# Altium project RK_NVR_DEMO1_RK3588_LP4XD200P232SD8_V21_20211228.PrjPcb (part 13 of 19)

## Sheet 67.Ethernet-GEPHY_RGMII0.SchDoc
size 420 x 297 mm; Revision: V2.1; Schematic Page Number: 11; Page Number: 31; Check: Default; Schematic Name: RK_NVR_DEMO1_RK3588_LP4/4x_V21; Page Count: 43; Page name: 67.Ethernet-GEPHY_RGMII0; Designer: Zhangdz; Schematic Page Count: 99; Revcode: V2.1; DsnPath: E:\Work\SBER\RK3588_SOM\temp\RK_NVR_DEMO1_RK3588_LP4XD200P232SD8_V21_20211228.DSN; SchematicName: RK_NVR_DEMO1_RK3588_LP4/4x_V21; PageName: 67.Ethernet-GEPHY_RGMII0; PageSize: A3; TopSchematic: True
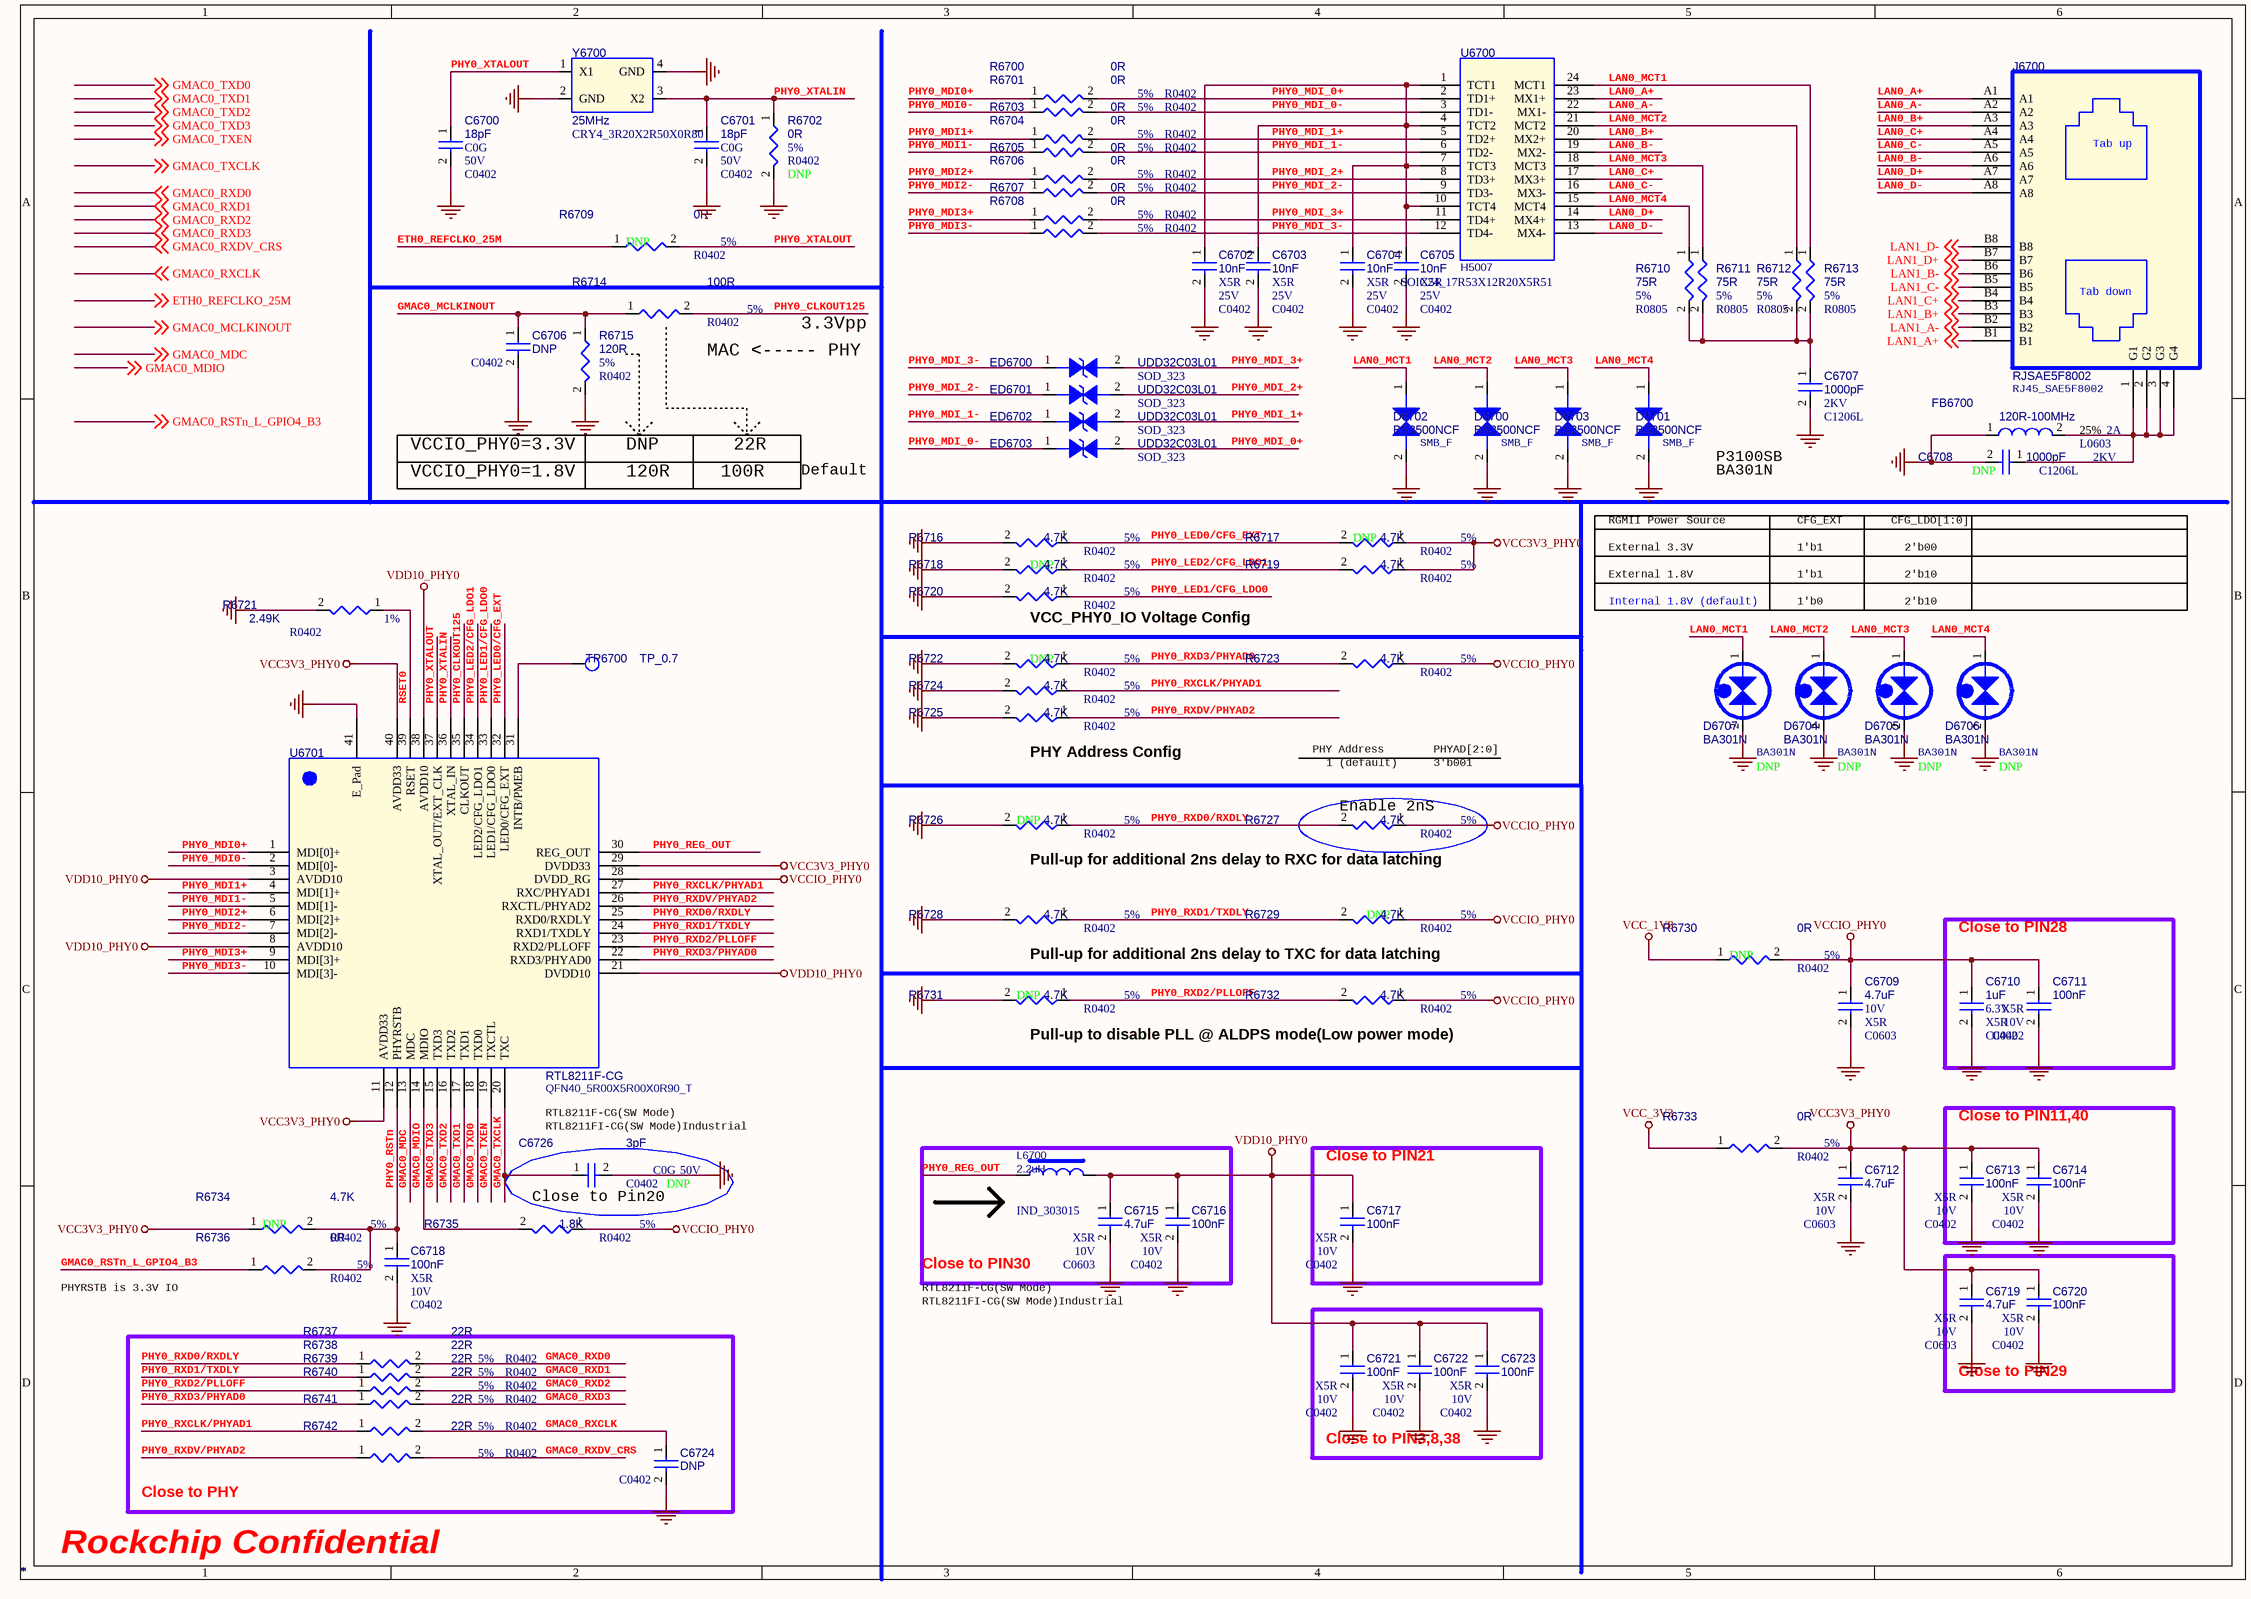
[diagram p58: 67.Ethernet-GEPHY_RGMII0.SchDoc]

### Parts
C6700  *  Voltage: 50V  Dielectric: C0G  [C0402]
C6701  *  Voltage: 50V  Dielectric: C0G  [C0402]
C6702  *  Voltage: 25V  Dielectric: X5R  [C0402]
C6703  *  Voltage: 25V  Dielectric: X5R  [C0402]
C6704  *  Voltage: 25V  Dielectric: X5R  [C0402]
C6705  *  Voltage: 25V  Dielectric: X5R  [C0402]
C6706  *  [C0402]
C6707  *  Voltage: 2KV  [C1206L]
C6708  *  Voltage: 2KV  option: DNP  [C1206L]
C6709  *  Voltage: 10V  Dielectric: X5R  [C0603]
C6710  *  Voltage: 6.3V  Dielectric: X5R  [C0402]
C6711  *  Voltage: 10V  Dielectric: X5R  [C0402]
C6712  *  Voltage: 10V  Dielectric: X5R  [C0603]
C6713  *  Voltage: 10V  Dielectric: X5R  [C0402]
C6714  *  Voltage: 10V  Dielectric: X5R  [C0402]
C6715  *  Voltage: 10V  Dielectric: X5R  [C0603]
C6716  *  Voltage: 10V  Dielectric: X5R  [C0402]
C6717  *  Voltage: 10V  Dielectric: X5R  [C0402]
C6718  *  Voltage: 10V  Dielectric: X5R  [C0402]
C6719  *  Voltage: 10V  Dielectric: X5R  [C0603]
C6720  *  Voltage: 10V  Dielectric: X5R  [C0402]
C6721  *  Voltage: 10V  Dielectric: X5R  [C0402]
C6722  *  Voltage: 10V  Dielectric: X5R  [C0402]
C6723  *  Voltage: 10V  Dielectric: X5R  [C0402]
C6724  *  [C0402]
C6726  *  Voltage: 50V  Dielectric: C0G  option: DNP  [C0402]
D6700  *  PCB Footprint: SMB_F  [BA301N]
D6701  *  PCB Footprint: SMB_F  [BA301N]
D6702  *  PCB Footprint: SMB_F  [BA301N]
D6703  *  PCB Footprint: SMB_F  [BA301N]
D6704  *  option: DNP  [BA301N]
D6705  *  option: DNP  [BA301N]
D6706  *  option: DNP  [BA301N]
D6707  *  option: DNP  [BA301N]
ED6700  *  [SOD_323]
ED6701  *  [SOD_323]
ED6702  *  [SOD_323]
ED6703  *  [SOD_323]
FB6700  *  Tolerance: 25%  Irms: 2A  [L0603]
J6700  *  PCB Footprint: RJ45_SAE5F8002  [RJSAE5F8002]
L6700  *  [IND_303015]
R6700  *  Tolerance: 5%  [R0402]
R6701  *  Tolerance: 5%  [R0402]
R6702  *  Tolerance: 5%  option: DNP  [R0402]
R6703  *  Tolerance: 5%  [R0402]
R6704  *  Tolerance: 5%  [R0402]
R6705  *  Tolerance: 5%  [R0402]
R6706  *  Tolerance: 5%  [R0402]
R6707  *  Tolerance: 5%  [R0402]
R6708  *  Tolerance: 5%  [R0402]
R6709  *  Tolerance: 5%  Option: DNP  [R0402]
R6710  *  PCB Footprint: R0805  Tolerance: 5%  [R0402]
R6711  *  PCB Footprint: R0805  Tolerance: 5%  [R0402]
R6712  *  PCB Footprint: R0805  Tolerance: 5%  [R0402]
R6713  *  PCB Footprint: R0805  Tolerance: 5%  [R0402]
R6714  *  Tolerance: 5%  [R0402]
R6715  *  Tolerance: 5%  [R0402]
R6716  *  Tolerance: 5%  [R0402]
R6717  *  Tolerance: 5%  option: DNP  [R0402]
R6718  *  Tolerance: 5%  option: DNP  [R0402]
R6719  *  Tolerance: 5%  [R0402]
R6720  *  Tolerance: 5%  [R0402]
R6721  *  Tolerance: 1%  [R0402]
R6722  *  Tolerance: 5%  option: DNP  [R0402]
R6723  *  Tolerance: 5%  [R0402]
R6724  *  Tolerance: 5%  [R0402]
R6725  *  Tolerance: 5%  [R0402]
R6726  *  Tolerance: 5%  option: DNP  [R0402]
R6727  *  Tolerance: 5%  [R0402]
R6728  *  Tolerance: 5%  [R0402]
R6729  *  Tolerance: 5%  option: DNP  [R0402]
R6730  *  Tolerance: 5%  option: DNP  [R0402]
R6731  *  Tolerance: 5%  option: DNP  [R0402]
R6732  *  Tolerance: 5%  [R0402]
R6733  *  Tolerance: 5%  [R0402]
R6734  *  Tolerance: 5%  Option: DNP  [R0402]
R6735  *  Tolerance: 5%  [R0402]
R6736  *  Tolerance: 5%  [R0402]
R6737  *  Tolerance: 5%  [R0402]
R6738  *  Tolerance: 5%  [R0402]
R6739  *  Tolerance: 5%  [R0402]
R6740  *  Tolerance: 5%  [R0402]
R6741  *  Tolerance: 5%  [R0402]
R6742  *  Tolerance: 5%  [R0402]
TP6700  *  [TEST]
U6700  *  [SOIC24_17R53X12R20X5R51]
U6701  *  PCB Footprint: QFN40_5R00X5R00X0R90_T  [QFN40_5R00X5R00X0R80_T]
Y6700  *  PCB Footprint: CRY4_3R20X2R50X0R80  [CRY-3225]

### Blocks framed on the sheet
Close to PIN28: C6710 C6711
Close to PIN11,40: C6713 C6714
Close to PIN30: C6715 C6716 L6700
Close to PIN21: C6717
Close to PIN29: C6719 C6720
Close to PIN3,8,38: C6721-C6723
Close to PHY: C6724 R6737-R6742

### Nets
GND: C6700.2 C6701.2 C6702.2 C6703.2 C6704.2 C6705.2 C6706.2 C6707.2 C6708.2 C6709.2 C6710.2 C6711.2 C6712.2 C6713.2 C6714.2 C6715.2 C6716.2 C6717.2 C6718.2 C6719.2 C6720.2 C6721.2 C6722.2 C6723.2 C6724.2 C6726.2 D6700.2 D6701.2 D6702.2 D6703.2 D6704.2 D6705.2 D6706.2 D6707.2 FB6700.1 R6702.2 R6715.2 R6716.2 R6718.2 R6720.2 R6721.2 R6722.2 R6724.2 R6725.2 R6726.2 R6728.2 R6731.2 U6701.41(E_Pad) Y6700.2(GND) Y6700.4(GND)
VCC3V3_PHY0: C6712.1 C6713.1 C6714.1 C6719.1 C6720.1 R6717.1 R6719.1 R6733.2 R6734.1 U6701.11(AVDD33) U6701.29(DVDD33) U6701.40(AVDD33)
VCC_1V8: R6730.1
VCC_3V3: R6733.1
VCCIO_PHY0: C6709.1 C6710.1 C6711.1 R6723.1 R6727.1 R6729.1 R6730.2 R6732.1 R6735.1 U6701.28(DVDD_RG)
VDD10_PHY0: C6715.1 C6716.1 C6717.1 C6721.1 C6722.1 C6723.1 L6700.2 U6701.3(AVDD10) U6701.8(AVDD10) U6701.21(DVDD10) U6701.38(AVDD10)
ETH0_REFCLKO_25M: R6709.1 ; off-sheet ETH0_REFCLKO_25M
GMAC0_MCLKINOUT: C6706.1 R6714.1 R6715.1 ; off-sheet GMAC0_MCLKINOUT
GMAC0_MDC: U6701.13(MDC) ; off-sheet GMAC0_MDC
GMAC0_MDIO: R6735.2 U6701.14(MDIO) ; off-sheet GMAC0_MDIO
GMAC0_RSTn_L_GPIO4_B3: R6736.1 ; off-sheet GMAC0_RSTn_L_GPIO4_B3
GMAC0_RXCLK: C6724.1 R6741.2 ; off-sheet GMAC0_RXCLK
GMAC0_RXD0: R6737.2 ; off-sheet GMAC0_RXD0
GMAC0_RXD1: R6738.2 ; off-sheet GMAC0_RXD1
GMAC0_RXD2: R6739.2 ; off-sheet GMAC0_RXD2
GMAC0_RXD3: R6740.2 ; off-sheet GMAC0_RXD3
GMAC0_RXDV_CRS: R6742.2 ; off-sheet GMAC0_RXDV_CRS
GMAC0_TXCLK: C6726.1 U6701.20(TXC) ; off-sheet GMAC0_TXCLK
GMAC0_TXD0: U6701.18(TXD0) ; off-sheet GMAC0_TXD0
GMAC0_TXD1: U6701.17(TXD1) ; off-sheet GMAC0_TXD1
GMAC0_TXD2: U6701.16(TXD2) ; off-sheet GMAC0_TXD2
GMAC0_TXD3: U6701.15(TXD3) ; off-sheet GMAC0_TXD3
GMAC0_TXEN: U6701.19(TXCTL) ; off-sheet GMAC0_TXEN
LAN0_A+: J6700.A1 U6700.23(MX1+)
LAN0_A-: J6700.A2 U6700.22(MX1-)
LAN0_B+: J6700.A3 U6700.20(MX2+)
LAN0_B-: J6700.A6 U6700.19(MX2-)
LAN0_C+: J6700.A4 U6700.17(MX3+)
LAN0_C-: J6700.A5 U6700.16(MX3-)
LAN0_D+: J6700.A7 U6700.14(MX4+)
LAN0_D-: J6700.A8 U6700.13(MX4-)
LAN0_MCT1: D6702.1 D6707.1 R6713.1 U6700.24(MCT1)
LAN0_MCT2: D6700.1 D6704.1 R6712.1 U6700.21(MCT2)
LAN0_MCT3: D6703.1 D6705.1 R6711.1 U6700.18(MCT3)
LAN0_MCT4: D6701.1 D6706.1 R6710.1 U6700.15(MCT4)
LAN1_A+: J6700.B1 ; off-sheet LAN1_A+
LAN1_A-: J6700.B2 ; off-sheet LAN1_A-
LAN1_B+: J6700.B3 ; off-sheet LAN1_B+
LAN1_B-: J6700.B6 ; off-sheet LAN1_B-
LAN1_C+: J6700.B4 ; off-sheet LAN1_C+
LAN1_C-: J6700.B5 ; off-sheet LAN1_C-
LAN1_D+: J6700.B7 ; off-sheet LAN1_D+
LAN1_D-: J6700.B8 ; off-sheet LAN1_D-
PHY0_CLKOUT125: R6714.2 U6701.35(CLKOUT)
PHY0_LED0/CFG_EXT: R6716.1 R6717.2 U6701.32(LED0/CFG_EXT)
PHY0_LED1/CFG_LDO0: R6720.1 U6701.33(LED1/CFG_LDO0)
PHY0_LED2/CFG_LDO1: R6718.1 R6719.2 U6701.34(LED2/CFG_LDO1)
PHY0_MDI0+: R6700.1 U6701.1(MDI[0]+)
PHY0_MDI0-: R6701.1 U6701.2(MDI[0]-)
PHY0_MDI1+: R6703.1 U6701.4(MDI[1]+)
PHY0_MDI1-: R6704.1 U6701.5(MDI[1]-)
PHY0_MDI2+: R6705.1 U6701.6(MDI[2]+)
PHY0_MDI2-: R6706.1 U6701.7(MDI[2]-)
PHY0_MDI3+: R6707.1 U6701.9(MDI[3]+)
PHY0_MDI3-: R6708.1 U6701.10(MDI[3]-)
PHY0_MDI_0+: ED6703.2 R6700.2 U6700.2(TD1+)
PHY0_MDI_0-: ED6703.1 R6701.2 U6700.3(TD1-)
PHY0_MDI_1+: ED6702.2 R6703.2 U6700.5(TD2+)
PHY0_MDI_1-: ED6702.1 R6704.2 U6700.6(TD2-)
PHY0_MDI_2+: ED6701.2 R6705.2 U6700.8(TD3+)
PHY0_MDI_2-: ED6701.1 R6706.2 U6700.9(TD3-)
PHY0_MDI_3+: ED6700.2 R6707.2 U6700.11(TD4+)
PHY0_MDI_3-: ED6700.1 R6708.2 U6700.12(TD4-)
PHY0_REG_OUT: L6700.1 U6701.30(REG_OUT)
PHY0_RSTn: C6718.1 R6734.2 R6736.2 U6701.12(PHYRSTB)
PHY0_RXCLK/PHYAD1: R6724.1 R6741.1 U6701.27(RXC/PHYAD1)
PHY0_RXD0/RXDLY: R6726.1 R6727.2 R6737.1 U6701.25(RXD0/RXDLY)
PHY0_RXD1/TXDLY: R6728.1 R6729.2 R6738.1 U6701.24(RXD1/TXDLY)
PHY0_RXD2/PLLOFF: R6731.1 R6732.2 R6739.1 U6701.23(RXD2/PLLOFF)
PHY0_RXD3/PHYAD0: R6722.1 R6723.2 R6740.1 U6701.22(RXD3/PHYAD0)
PHY0_RXDV/PHYAD2: R6725.1 R6742.1 U6701.26(RXCTL/PHYAD2)
PHY0_XTALIN: C6701.1 R6702.1 U6701.36(XTAL_IN) Y6700.3(X2)
PHY0_XTALOUT: C6700.1 R6709.2 U6701.37(XTAL_OUT/EXT_CLK) Y6700.1(X1)
RSET0: R6721.1 U6701.39(RSET)
NetC6702_1: C6702.1 C6703.1 C6704.1 C6705.1 U6700.1(TCT1) U6700.4(TCT2) U6700.7(TCT3) U6700.10(TCT4)
NetC6707_1: C6707.1 R6710.2 R6711.2 R6712.2 R6713.2
NetC6708_1: C6708.1 FB6700.2 J6700.1(G1) J6700.2(G2) J6700.3(G3) J6700.4(G4)
NetTP6700_1: TP6700.1 U6701.31(INTB/PMEB)

### Notes on the sheet
- (near R6714) MAC <----- PHY
- 3.3Vpp
- VCCIO_PHY0=3.3V
- DNP
- 22R
- P3100SB
- VCCIO_PHY0=1.8V
- 120R
- 100R
- Default
- RGMII Power Source
- BA301N
- CFG_EXT
- CFG_LDO[1:0]
- External 3.3V
- External 1.8V
- 1'b1
- 2'b00
- 2'b10
- (near R6720) VCC_PHY0_IO Voltage Config
- Internal 1.8V (default)
- 1'b0
- (near R6725) PHY Address Config
- PHY Address
- 1 (default)
- PHYAD[2:0]
- 3'b001
- Pull-up for additional 2ns delay to RXC for data latching
- (near R6727) Enable 2nS
- Pull-up for additional 2ns delay to TXC for data latching
- Pull-up to disable PLL @ ALDPS mode(Low power mode)
- RTL8211F-CG(SW Mode)
- RTL8211FI-CG(SW Mode)Industrial
- Close to Pin20
- PHYRSTB is 3.3V IO
- Rockchip Confidential
- (in symbol RJSAE5F8002) Tab up; Tab down

### Library data of the parts
C6700 = CAP NP: cap,18.00pF,+/-5%,50V,C0G,C0402; Part Reference: C6700; Manufacturer: TDK; Value: 18pF; RK PN: C1005C0G1H180J050BA; Priority: A; Tolerance: 5%; PCB Footprint: C0402; Part Type: C0402; Manufacturer PN: C1005C0G1H180J050BA; Created by: JJJ
C6701 = CAP NP: cap,18.00pF,+/-5%,50V,C0G,C0402; Part Reference: C6701; Manufacturer: TDK; Value: 18pF; RK PN: C1005C0G1H180J050BA; Priority: A; Tolerance: 5%; PCB Footprint: C0402; Part Type: C0402; Manufacturer PN: C1005C0G1H180J050BA; Created by: JJJ
C6702 = CAP NP: cap,10.00nF,+/-10%,25V,X5R,C0402; Part Reference: C6702; Manufacturer: TDK; Value: 10nF; RK PN: C1005X5R1E103K050BA; Priority: A; Tolerance: 10%; PCB Footprint: C0402; Part Type: C0402; Manufacturer PN: C1005X5R1E103K050BA; Created by: JJJ
C6703 = CAP NP: cap,10.00nF,+/-10%,25V,X5R,C0402; Part Reference: C6703; Manufacturer: TDK; Value: 10nF; RK PN: C1005X5R1E103K050BA; Priority: A; Tolerance: 10%; PCB Footprint: C0402; Part Type: C0402; Manufacturer PN: C1005X5R1E103K050BA; Created by: JJJ
C6704 = CAP NP: cap,10.00nF,+/-10%,25V,X5R,C0402; Part Reference: C6704; Manufacturer PN: C1005X5R1E103K050BA; Manufacturer: TDK; Value: 10nF; Tolerance: 10%; Priority: A; PCB Footprint: C0402; Created by: JJJ; Part Type: C0402; RK PN: C1005X5R1E103K050BA
C6705 = CAP NP: cap,10.00nF,+/-10%,25V,X5R,C0402; Part Reference: C6705; Manufacturer PN: C1005X5R1E103K050BA; Manufacturer: TDK; Value: 10nF; Tolerance: 10%; Priority: A; PCB Footprint: C0402; Created by: JJJ; Part Type: C0402; RK PN: C1005X5R1E103K050BA
C6706 = CAP NP: Did Not Place.; Part Reference: C6706; Value: DNP; Number: 37; RK PN: DNPC0402; Priority: A; C_Voltage: 6.3V; PCB Footprint: C0402; Part Type: DNP; Manufacturer PN: DNPC0402; Created by: JJJ
C6707 = CAP NP: ёЯС№µзИЭ,1000pF/2KV,C1206; Part Reference: C6707; Value: 1000pF; RK PN: CTY1AC250V2E4102M2B; Priority: A; Tolerance: 20%; PCB Footprint: C1206L; Part Type: ёЯС№µзИЭ; Manufacturer PN: CTY1AC250V2E4102M2B; Created by: JJJ
C6708 = CAP NP: ёЯС№µзИЭ,1000pF/2KV,C1206; Part Reference: C6708; Manufacturer PN: CTY1AC250V2E4102M2B; Value: 1000pF; Tolerance: 20%; Priority: A; PCB Footprint: C1206L; Created by: JJJ; Part Type: ёЯС№µзИЭ; RK PN: CTY1AC250V2E4102M2B
C6709 = CAP NP: cap,4.70uF,+/-10%,10V,X5R,C0603; Part Reference: C6709; Manufacturer: TDK; Value: 4.7uF; RK PN: C1608X5R1A475K080AC; Priority: A; C_Voltage: 6.3V; Tolerance: 10%; PCB Footprint: C0603; Part Type: C0603; Manufacturer PN: C1608X5R1A475K080AC; Created by: JJJ
C6710 = CAP NP: cap,1.00uF,+/-10%,6.3V,X5R,C0402; Part Reference: C6710; Manufacturer: TDK; Value: 1uF; RK PN: C1005X5R0J105K050BB; Priority: A; Tolerance: 10%; PCB Footprint: C0402; Part Type: C0402; C_Voltage: 6.3V; Manufacturer PN: C1005X5R0J105K050BB; Created by: JJJ
C6711 = CAP NP: cap,100.00nF,+/-10%,10V,X5R,C0402; Part Reference: C6711; Manufacturer: TDK; Value: 100nF; Number: 37; RK PN: C1005X5R1A104K050BA; Priority: A; Tolerance: 10%; C_Voltage: 6.3V; PCB Footprint: C0402; Part Type: C0402; Manufacturer PN: C1005X5R1A104K050BA; Created by: JJJ
C6712 = CAP NP: cap,4.70uF,+/-10%,10V,X5R,C0603; Part Reference: C6712; Manufacturer PN: C1608X5R1A475K080AC; Manufacturer: TDK; Value: 4.7uF; Tolerance: 10%; C_Voltage: 6.3V; Priority: A; PCB Footprint: C0603; Created by: JJJ; Part Type: C0603; RK PN: C1608X5R1A475K080AC
C6713 = CAP NP: cap,100.00nF,+/-10%,10V,X5R,C0402; Part Reference: C6713; Manufacturer: TDK; Value: 100nF; Number: 37; RK PN: C1005X5R1A104K050BA; Priority: A; Tolerance: 10%; C_Voltage: 6.3V; PCB Footprint: C0402; Part Type: C0402; Manufacturer PN: C1005X5R1A104K050BA; Created by: JJJ
C6714 = CAP NP: cap,100.00nF,+/-10%,10V,X5R,C0402; Part Reference: C6714; Manufacturer: TDK; Value: 100nF; Number: 37; RK PN: C1005X5R1A104K050BA; Priority: A; Tolerance: 10%; C_Voltage: 6.3V; PCB Footprint: C0402; Part Type: C0402; Manufacturer PN: C1005X5R1A104K050BA; Created by: JJJ
C6715 = CAP NP: cap,4.70uF,+/-10%,10V,X5R,C0603; Part Reference: C6715; Manufacturer PN: C1608X5R1A475K080AC; Manufacturer: TDK; Value: 4.7uF; Tolerance: 10%; C_Voltage: 6.3V; Priority: A; PCB Footprint: C0603; Created by: JJJ; Part Type: C0603; RK PN: C1608X5R1A475K080AC
C6716 = CAP NP: cap,100.00nF,+/-10%,10V,X5R,C0402; Part Reference: C6716; Manufacturer PN: C1005X5R1A104K050BA; Manufacturer: TDK; Value: 100nF; C_Voltage: 6.3V; Tolerance: 10%; Priority: A; Number: 37; PCB Footprint: C0402; Created by: JJJ; Part Type: C0402; RK PN: C1005X5R1A104K050BA
C6717 = CAP NP: cap,100.00nF,+/-10%,10V,X5R,C0402; Part Reference: C6717; Manufacturer PN: C1005X5R1A104K050BA; Manufacturer: TDK; Value: 100nF; C_Voltage: 6.3V; Tolerance: 10%; Priority: A; Number: 37; PCB Footprint: C0402; Created by: JJJ; Part Type: C0402; RK PN: C1005X5R1A104K050BA
C6718 = CAP NP: cap,100.00nF,+/-10%,10V,X5R,C0402; Part Reference: C6718; Manufacturer PN: C1005X5R1A104K050BA; Manufacturer: TDK; Value: 100nF; Tolerance: 10%; Priority: A; PCB Footprint: C0402; Created by: JJJ; Part Type: C0402; RK PN: C1005X5R1A104K050BA
C6719 = CAP NP: cap,4.70uF,+/-10%,10V,X5R,C0603; Part Reference: C6719; Manufacturer PN: C1608X5R1A475K080AC; Manufacturer: TDK; Value: 4.7uF; Tolerance: 10%; C_Voltage: 6.3V; Priority: A; PCB Footprint: C0603; Created by: JJJ; Part Type: C0603; RK PN: C1608X5R1A475K080AC
C6720 = CAP NP: cap,100.00nF,+/-10%,10V,X5R,C0402; Part Reference: C6720; Manufacturer: TDK; Value: 100nF; Number: 37; RK PN: C1005X5R1A104K050BA; Priority: A; Tolerance: 10%; C_Voltage: 6.3V; PCB Footprint: C0402; Part Type: C0402; Manufacturer PN: C1005X5R1A104K050BA; Created by: JJJ
C6721 = CAP NP: cap,100.00nF,+/-10%,10V,X5R,C0402; Part Reference: C6721; Manufacturer: TDK; Value: 100nF; Number: 37; RK PN: C1005X5R1A104K050BA; Priority: A; Tolerance: 10%; C_Voltage: 6.3V; PCB Footprint: C0402; Part Type: C0402; Manufacturer PN: C1005X5R1A104K050BA; Created by: JJJ
C6722 = CAP NP: cap,100.00nF,+/-10%,10V,X5R,C0402; Part Reference: C6722; Manufacturer: TDK; Value: 100nF; Number: 37; RK PN: C1005X5R1A104K050BA; Priority: A; Tolerance: 10%; C_Voltage: 6.3V; PCB Footprint: C0402; Part Type: C0402; Manufacturer PN: C1005X5R1A104K050BA; Created by: JJJ
C6723 = CAP NP: cap,100.00nF,+/-10%,10V,X5R,C0402; Part Reference: C6723; Manufacturer: TDK; Value: 100nF; Number: 37; RK PN: C1005X5R1A104K050BA; Priority: A; Tolerance: 10%; C_Voltage: 6.3V; PCB Footprint: C0402; Part Type: C0402; Manufacturer PN: C1005X5R1A104K050BA; Created by: JJJ
C6724 = CAP NP: Did Not Place.; Part Reference: C6724; Value: DNP; Number: 37; RK PN: DNPC0402; Priority: A; C_Voltage: 6.3V; PCB Footprint: C0402; Part Type: DNP; Manufacturer PN: DNPC0402; Created by: JJJ
C6726 = CAP NP: cap,3.00pF,+/-0.25,50V,C0G,C0402; Part Reference: C6726; Manufacturer: TDK; Value: 3pF; RK PN: C1005C0G1H030C050BA; Priority: A; Tolerance: +/-0.25pF; PCB Footprint: C0402; Part Type: C0402; Manufacturer PN: C1005C0G1H030C050BA; Created by: JJJ
D6700 = BA301N_3: Part Reference: D6700; Value: BS3500NCF
D6701 = BA301N_3: Part Reference: D6701; Value: BS3500NCF
D6702 = BA301N_3: Part Reference: D6702; Value: BS3500NCF
D6703 = BA301N_3: Part Reference: D6703; Value: BS3500NCF
D6704 = BA301N_1: Part Reference: D6704; Value: BA301N; PCB Footprint: BA301N
D6705 = BA301N_1: Part Reference: D6705; Value: BA301N; PCB Footprint: BA301N
D6706 = BA301N_1: Part Reference: D6706; Value: BA301N; PCB Footprint: BA301N
D6707 = BA301N_1: Part Reference: D6707; Value: BA301N; PCB Footprint: BA301N
ED6700 = DIODE BI_DIR TRIG: Transient Voltage Suppressor,0.8pF; Part Reference: ED6700; Manufacturer PN: ESD5451N; Manufacturer: WillSemi(О¤¶ы°лµјМе); Value: UDD32C03L01; Priority: A; PCB Footprint: SOD_323; Created by: JJJ; Part Type: ESD_TVS; RK PN: ESD5451N
ED6701 = DIODE BI_DIR TRIG: Transient Voltage Suppressor,0.8pF; Part Reference: ED6701; Manufacturer PN: ESD5451N; Manufacturer: WillSemi(О¤¶ы°лµјМе); Value: UDD32C03L01; Priority: A; PCB Footprint: SOD_323; Created by: JJJ; Part Type: ESD_TVS; RK PN: ESD5451N
ED6702 = DIODE BI_DIR TRIG: Transient Voltage Suppressor,0.8pF; Part Reference: ED6702; Manufacturer PN: ESD5451N; Manufacturer: WillSemi(О¤¶ы°лµјМе); Value: UDD32C03L01; Priority: A; PCB Footprint: SOD_323; Created by: JJJ; Part Type: ESD_TVS; RK PN: ESD5451N
ED6703 = DIODE BI_DIR TRIG: Transient Voltage Suppressor,0.8pF; Part Reference: ED6703; Manufacturer PN: ESD5451N; Manufacturer: WillSemi(О¤¶ы°лµјМе); Value: UDD32C03L01; Priority: A; PCB Footprint: SOD_323; Created by: JJJ; Part Type: ESD_TVS; RK PN: ESD5451N
FB6700 = BEAD: BEAD,120R@100MHz,current=2000mA,0603; Part Reference: FB6700; Manufacturer: Murata; DC Resistor: 0.030ohm; Value: 120R-100MHz; RK PN: BLM18KG121TN1; Priority: L; PCB Footprint: L0603; Part Type: BEAD; Manufacturer PN: BLM18KG121TN1; Created by: DZS
J6700 = RJSAE5F8002: Part Reference: J6700; Value: RJSAE5F8002
L6700 = INDUCTORS OF FERRITE_Dup1: Power Inductor,2.2uH,0.3,IND_303015; Part Reference: L6700; Manufacturer PN: SWPA3015S2R2NT; Manufacturer: sunlord; Isat: 1.6A; DC Resistor: 0.06ohm; Resonace frequency: 86M; Tolerance: 30%; Priority: A; PCB Footprint: IND_303015; Value: 2.2uH; Created by: YTL; Irms: 1.6A; Part Type: POWER_IND; RK PN: SWPA3015S2R2NT
R6700 = RESISTOR_Dup1: НЁУГєсД¤µзЧи,0R,+/-5%,R0402,1/16W.; Part Reference: R6700; Manufacturer PN: RC0402JR-070RL; Manufacturer: YAGEO; Wattage: 1/16W; Priority: A; PCB Footprint: R0402; Value: 0R; Created by: YTL; Part Type: НЁУГєсД¤µзЧи; RK PN: RC0402JR-070RL
R6701 = RESISTOR_Dup1: НЁУГєсД¤µзЧи,0R,+/-5%,R0402,1/16W.; Part Reference: R6701; Manufacturer PN: RC0402JR-070RL; Manufacturer: YAGEO; Wattage: 1/16W; Priority: A; PCB Footprint: R0402; Value: 0R; Created by: YTL; Part Type: НЁУГєсД¤µзЧи; RK PN: RC0402JR-070RL
R6702 = RESISTOR_Dup1: НЁУГєсД¤µзЧи,0R,+/-5%,R0402,1/16W.; Part Reference: R6702; Manufacturer: YAGEO; RK PN: RC0402JR-070RL; Priority: A; Wattage: 1/16W; PCB Footprint: R0402; Value: 0R; Part Type: НЁУГєсД¤µзЧи; Manufacturer PN: RC0402JR-070RL; Created by: YTL
R6703 = RESISTOR_Dup1: НЁУГєсД¤µзЧи,0R,+/-5%,R0402,1/16W.; Part Reference: R6703; Manufacturer PN: RC0402JR-070RL; Manufacturer: YAGEO; Wattage: 1/16W; Priority: A; PCB Footprint: R0402; Value: 0R; Created by: YTL; Part Type: НЁУГєсД¤µзЧи; RK PN: RC0402JR-070RL
R6704 = RESISTOR_Dup1: НЁУГєсД¤µзЧи,0R,+/-5%,R0402,1/16W.; Part Reference: R6704; Manufacturer PN: RC0402JR-070RL; Manufacturer: YAGEO; Wattage: 1/16W; Priority: A; PCB Footprint: R0402; Value: 0R; Created by: YTL; Part Type: НЁУГєсД¤µзЧи; RK PN: RC0402JR-070RL
R6705 = RESISTOR_Dup1: НЁУГєсД¤µзЧи,0R,+/-5%,R0402,1/16W.; Part Reference: R6705; Manufacturer PN: RC0402JR-070RL; Manufacturer: YAGEO; Wattage: 1/16W; Priority: A; PCB Footprint: R0402; Value: 0R; Created by: YTL; Part Type: НЁУГєсД¤µзЧи; RK PN: RC0402JR-070RL
R6706 = RESISTOR_Dup1: НЁУГєсД¤µзЧи,0R,+/-5%,R0402,1/16W.; Part Reference: R6706; Manufacturer PN: RC0402JR-070RL; Manufacturer: YAGEO; Wattage: 1/16W; Priority: A; PCB Footprint: R0402; Value: 0R; Created by: YTL; Part Type: НЁУГєсД¤µзЧи; RK PN: RC0402JR-070RL
R6707 = RESISTOR_Dup1: НЁУГєсД¤µзЧи,0R,+/-5%,R0402,1/16W.; Part Reference: R6707; Manufacturer PN: RC0402JR-070RL; Manufacturer: YAGEO; Wattage: 1/16W; Priority: A; PCB Footprint: R0402; Value: 0R; Created by: YTL; Part Type: НЁУГєсД¤µзЧи; RK PN: RC0402JR-070RL
R6708 = RESISTOR_Dup1: НЁУГєсД¤µзЧи,0R,+/-5%,R0402,1/16W.; Part Reference: R6708; Manufacturer PN: RC0402JR-070RL; Manufacturer: YAGEO; Wattage: 1/16W; Priority: A; PCB Footprint: R0402; Value: 0R; Created by: YTL; Part Type: НЁУГєсД¤µзЧи; RK PN: RC0402JR-070RL
R6709 = RESISTOR_Dup1: НЁУГєсД¤µзЧи,0R,+/-5%,R0402,1/16W.; Part Reference: R6709; Manufacturer: YAGEO; RK PN: RC0402JR-070RL; Priority: A; Wattage: 1/16W; PCB Footprint: R0402; Value: 0R; Part Type: НЁУГєсД¤µзЧи; Manufacturer PN: RC0402JR-070RL; Created by: YTL
R6710 = RESISTOR_Dup1: НЁУГєсД¤µзЧи,75R,+/-5%,R0805,1/8W.; Part Reference: R6710; Manufacturer: YAGEO; RK PN: RC0805JR-0775RL; Priority: A; Wattage: 1/8W; Value: 75R; Part Type: НЁУГєсД¤µзЧи; Manufacturer PN: RC0805JR-0775RL; Created by: YTL
R6711 = RESISTOR_Dup1: НЁУГєсД¤µзЧи,75R,+/-5%,R0805,1/8W.; Part Reference: R6711; Manufacturer: YAGEO; RK PN: RC0805JR-0775RL; Priority: A; Wattage: 1/8W; Value: 75R; Part Type: НЁУГєсД¤µзЧи; Manufacturer PN: RC0805JR-0775RL; Created by: YTL
R6712 = RESISTOR_Dup1: НЁУГєсД¤µзЧи,75R,+/-5%,R0805,1/8W.; Part Reference: R6712; Manufacturer: YAGEO; RK PN: RC0805JR-0775RL; Priority: A; Wattage: 1/8W; Value: 75R; Part Type: НЁУГєсД¤µзЧи; Manufacturer PN: RC0805JR-0775RL; Created by: YTL
R6713 = RESISTOR_Dup1: НЁУГєсД¤µзЧи,75R,+/-5%,R0805,1/8W.; Part Reference: R6713; Manufacturer PN: RC0805JR-0775RL; Manufacturer: YAGEO; Wattage: 1/8W; Priority: A; Value: 75R; Created by: YTL; Part Type: НЁУГєсД¤µзЧи; RK PN: RC0805JR-0775RL
R6714 = RESISTOR_Dup1: НЁУГєсД¤µзЧи,100R,+/-5%,R0402,1/16W.; Part Reference: R6714; Manufacturer: YAGEO; RK PN: RC0402JR-07100RL; Priority: A; Wattage: 1/16W; Option: DNP; PCB Footprint: R0402; Value: 100R; Part Type: НЁУГєсД¤µзЧи; Manufacturer PN: RC0402JR-07100RL; Created by: YTL
R6715 = RESISTOR_Dup1: НЁУГєсД¤µзЧи,120R,+/-5%,R0402,1/16W.; Part Reference: R6715; Manufacturer PN: RC0402JR-07120RL; Manufacturer: YAGEO; Wattage: 1/16W; Priority: A; Option: DNP; PCB Footprint: R0402; Value: 120R; Created by: YTL; Part Type: НЁУГєсД¤µзЧи; RK PN: RC0402JR-07120RL
R6716 = RESISTOR_Dup1: НЁУГєсД¤µзЧи,4K7,+/-5%,R0402,1/16W.; Part Reference: R6716; Manufacturer PN: RC0402JR-074K7L; Manufacturer: YAGEO; Value: 4.7K; Wattage: 1/16W; Priority: A; PCB Footprint: R0402; Created by: YTL; Part Type: НЁУГєсД¤µзЧи; RK PN: RC0402JR-074K7L
R6717 = RESISTOR_Dup1: НЁУГєсД¤µзЧи,4K7,+/-5%,R0402,1/16W.; Part Reference: R6717; Manufacturer: YAGEO; Value: 4.7K; RK PN: RC0402JR-074K7L; Priority: A; Wattage: 1/16W; PCB Footprint: R0402; Part Type: НЁУГєсД¤µзЧи; Manufacturer PN: RC0402JR-074K7L; Created by: YTL
R6718 = RESISTOR_Dup1: НЁУГєсД¤µзЧи,4K7,+/-5%,R0402,1/16W.; Part Reference: R6718; Manufacturer PN: RC0402JR-074K7L; Manufacturer: YAGEO; Value: 4.7K; Wattage: 1/16W; Priority: A; PCB Footprint: R0402; Created by: YTL; Part Type: НЁУГєсД¤µзЧи; RK PN: RC0402JR-074K7L
R6719 = RESISTOR_Dup1: НЁУГєсД¤µзЧи,4K7,+/-5%,R0402,1/16W.; Part Reference: R6719; Manufacturer: YAGEO; Value: 4.7K; RK PN: RC0402JR-074K7L; Priority: A; Wattage: 1/16W; PCB Footprint: R0402; Part Type: НЁУГєсД¤µзЧи; Manufacturer PN: RC0402JR-074K7L; Created by: YTL
R6720 = RESISTOR_Dup1: НЁУГєсД¤µзЧи,4K7,+/-5%,R0402,1/16W.; Part Reference: R6720; Manufacturer PN: RC0402JR-074K7L; Manufacturer: YAGEO; Value: 4.7K; Wattage: 1/16W; Priority: A; PCB Footprint: R0402; Created by: YTL; Part Type: НЁУГєсД¤µзЧи; RK PN: RC0402JR-074K7L
R6721 = RESISTOR_Dup1: НЁУГєсД¤µзЧи,2K49,+/-1%,R0402,1/16W.; Part Reference: R6721; Manufacturer PN: RC0402FR-072K49L; Manufacturer: YAGEO; Value: 2.49K; Wattage: 1/16W; Priority: A; PCB Footprint: R0402; Created by: YTL; Part Type: НЁУГєсД¤µзЧи; RK PN: RC0402FR-072K49L
R6722 = RESISTOR_Dup1: НЁУГєсД¤µзЧи,4K7,+/-5%,R0402,1/16W.; Part Reference: R6722; Manufacturer PN: RC0402JR-074K7L; Manufacturer: YAGEO; Value: 4.7K; Wattage: 1/16W; Priority: A; PCB Footprint: R0402; Created by: YTL; Part Type: НЁУГєсД¤µзЧи; RK PN: RC0402JR-074K7L
R6723 = RESISTOR_Dup1: НЁУГєсД¤µзЧи,4K7,+/-5%,R0402,1/16W.; Part Reference: R6723; Manufacturer: YAGEO; Value: 4.7K; RK PN: RC0402JR-074K7L; Priority: A; Wattage: 1/16W; PCB Footprint: R0402; Part Type: НЁУГєсД¤µзЧи; Manufacturer PN: RC0402JR-074K7L; Created by: YTL
R6724 = RESISTOR_Dup1: НЁУГєсД¤µзЧи,4K7,+/-5%,R0402,1/16W.; Part Reference: R6724; Manufacturer PN: RC0402JR-074K7L; Manufacturer: YAGEO; Value: 4.7K; Wattage: 1/16W; Priority: A; PCB Footprint: R0402; Created by: YTL; Part Type: НЁУГєсД¤µзЧи; RK PN: RC0402JR-074K7L
R6725 = RESISTOR_Dup1: НЁУГєсД¤µзЧи,4K7,+/-5%,R0402,1/16W.; Part Reference: R6725; Manufacturer PN: RC0402JR-074K7L; Manufacturer: YAGEO; Value: 4.7K; Wattage: 1/16W; Priority: A; PCB Footprint: R0402; Created by: YTL; Part Type: НЁУГєсД¤µзЧи; RK PN: RC0402JR-074K7L
R6726 = RESISTOR_Dup1: НЁУГєсД¤µзЧи,4K7,+/-5%,R0402,1/16W.; Part Reference: R6726; Manufacturer: YAGEO; Value: 4.7K; RK PN: RC0402JR-074K7L; Priority: A; Wattage: 1/16W; PCB Footprint: R0402; Part Type: НЁУГєсД¤µзЧи; Manufacturer PN: RC0402JR-074K7L; Created by: YTL
R6727 = RESISTOR_Dup1: НЁУГєсД¤µзЧи,4K7,+/-5%,R0402,1/16W.; Part Reference: R6727; Manufacturer: YAGEO; Value: 4.7K; RK PN: RC0402JR-074K7L; Priority: A; Wattage: 1/16W; PCB Footprint: R0402; Part Type: НЁУГєсД¤µзЧи; Manufacturer PN: RC0402JR-074K7L; Created by: YTL
R6728 = RESISTOR_Dup1: НЁУГєсД¤µзЧи,4K7,+/-5%,R0402,1/16W.; Part Reference: R6728; Manufacturer PN: RC0402JR-074K7L; Manufacturer: YAGEO; Value: 4.7K; Wattage: 1/16W; Priority: A; PCB Footprint: R0402; Created by: YTL; Part Type: НЁУГєсД¤µзЧи; RK PN: RC0402JR-074K7L
R6729 = RESISTOR_Dup1: НЁУГєсД¤µзЧи,4K7,+/-5%,R0402,1/16W.; Part Reference: R6729; Manufacturer: YAGEO; Value: 4.7K; RK PN: RC0402JR-074K7L; Priority: A; Wattage: 1/16W; PCB Footprint: R0402; Part Type: НЁУГєсД¤µзЧи; Manufacturer PN: RC0402JR-074K7L; Created by: YTL
R6730 = RESISTOR_Dup1: НЁУГєсД¤µзЧи,0R,+/-5%,R0402,1/16W.; Part Reference: R6730; Manufacturer: YAGEO; RK PN: RC0402JR-070RL; Priority: A; Wattage: 1/16W; PCB Footprint: R0402; Value: 0R; Part Type: НЁУГєсД¤µзЧи; Manufacturer PN: RC0402JR-070RL; Created by: YTL
R6731 = RESISTOR_Dup1: НЁУГєсД¤µзЧи,4K7,+/-5%,R0402,1/16W.; Part Reference: R6731; Manufacturer: YAGEO; Value: 4.7K; RK PN: RC0402JR-074K7L; Priority: A; Wattage: 1/16W; PCB Footprint: R0402; Part Type: НЁУГєсД¤µзЧи; Manufacturer PN: RC0402JR-074K7L; Created by: YTL
R6732 = RESISTOR_Dup1: НЁУГєсД¤µзЧи,4K7,+/-5%,R0402,1/16W.; Part Reference: R6732; Manufacturer: YAGEO; Value: 4.7K; RK PN: RC0402JR-074K7L; Priority: A; Wattage: 1/16W; PCB Footprint: R0402; Part Type: НЁУГєсД¤µзЧи; Manufacturer PN: RC0402JR-074K7L; Created by: YTL
R6733 = RESISTOR_Dup1: НЁУГєсД¤µзЧи,0R,+/-5%,R0402,1/16W.; Part Reference: R6733; Manufacturer PN: RC0402JR-070RL; Manufacturer: YAGEO; Wattage: 1/16W; Priority: A; PCB Footprint: R0402; Value: 0R; Created by: YTL; Part Type: НЁУГєсД¤µзЧи; RK PN: RC0402JR-070RL
R6734 = RESISTOR_Dup1: НЁУГєсД¤µзЧи,4K7,+/-5%,R0402,1/16W.; Part Reference: R6734; Manufacturer: YAGEO; Value: 4.7K; RK PN: RC0402JR-074K7L; Priority: A; Wattage: 1/16W; PCB Footprint: R0402; Part Type: НЁУГєсД¤µзЧи; Manufacturer PN: RC0402JR-074K7L; Created by: YTL
R6735 = RESISTOR_Dup1: НЁУГєсД¤µзЧи,1K8,+/-5%,R0402,1/16W.; Part Reference: R6735; Manufacturer PN: RC0402JR-071K8L; Manufacturer: YAGEO; Value: 1.8K; Wattage: 1/16W; Priority: A; PCB Footprint: R0402; Created by: YTL; Part Type: НЁУГєсД¤µзЧи; RK PN: RC0402JR-071K8L
R6736 = RESISTOR_Dup1: НЁУГєсД¤µзЧи,0R,+/-5%,R0402,1/16W.; Part Reference: R6736; Manufacturer: YAGEO; RK PN: RC0402JR-070RL; Priority: A; Wattage: 1/16W; PCB Footprint: R0402; Value: 0R; Part Type: НЁУГєсД¤µзЧи; Manufacturer PN: RC0402JR-070RL; Created by: YTL
R6737 = RESISTOR_Dup1: НЁУГєсД¤µзЧи,22R,+/-5%,R0402,1/16W.; Part Reference: R6737; Manufacturer: YAGEO; RK PN: RC0402JR-0722RL; Priority: A; Wattage: 1/16W; PCB Footprint: R0402; Value: 22R; Part Type: НЁУГєсД¤µзЧи; Manufacturer PN: RC0402JR-0722RL; Created by: YTL
R6738 = RESISTOR_Dup1: НЁУГєсД¤µзЧи,22R,+/-5%,R0402,1/16W.; Part Reference: R6738; Manufacturer PN: RC0402JR-0722RL; Manufacturer: YAGEO; Wattage: 1/16W; Priority: A; PCB Footprint: R0402; Value: 22R; Created by: YTL; Part Type: НЁУГєсД¤µзЧи; RK PN: RC0402JR-0722RL
R6739 = RESISTOR_Dup1: НЁУГєсД¤µзЧи,22R,+/-5%,R0402,1/16W.; Part Reference: R6739; Manufacturer PN: RC0402JR-0722RL; Manufacturer: YAGEO; Wattage: 1/16W; Priority: A; PCB Footprint: R0402; Value: 22R; Created by: YTL; Part Type: НЁУГєсД¤µзЧи; RK PN: RC0402JR-0722RL
R6740 = RESISTOR_Dup1: НЁУГєсД¤µзЧи,22R,+/-5%,R0402,1/16W.; Part Reference: R6740; Manufacturer PN: RC0402JR-0722RL; Manufacturer: YAGEO; Wattage: 1/16W; Priority: A; PCB Footprint: R0402; Value: 22R; Created by: YTL; Part Type: НЁУГєсД¤µзЧи; RK PN: RC0402JR-0722RL
R6741 = RESISTOR_Dup1: НЁУГєсД¤µзЧи,22R,+/-5%,R0402,1/16W.; Part Reference: R6741; Manufacturer PN: RC0402JR-0722RL; Manufacturer: YAGEO; Wattage: 1/16W; Priority: A; PCB Footprint: R0402; Value: 22R; Created by: YTL; Part Type: НЁУГєсД¤µзЧи; RK PN: RC0402JR-0722RL
R6742 = RESISTOR_Dup1: НЁУГєсД¤µзЧи,22R,+/-5%,R0402,1/16W.; Part Reference: R6742; Manufacturer PN: RC0402JR-0722RL; Manufacturer: YAGEO; Wattage: 1/16W; Priority: A; PCB Footprint: R0402; Value: 22R; Created by: YTL; Part Type: НЁУГєсД¤µзЧи; RK PN: RC0402JR-0722RL
TP6700 = TP: Test Point 0.7mm; Part Reference: TP6700; PCB Footprint: TP_0R70; Value: TP_0.7; Priority: A; RK PN: TESTPOINT_0R7; Created by: JJJ; Part Type: TP
U6700 = Ethernet_H5007: Gigabit Ethernet (1000Base-T); Part Reference: U6700; Manufacturer: Pulse; Value: H5007; Priority: A; PCB Footprint: SOIC24_17R53X12R20X5R51; RK PN: H5007; Part Type: Ethernet; Manufacturer PN: H5007; Created by: JJJ
U6701 = Ethernet_RTL8211F: Integrated 10/100/1000 Gigabit Ethernet TransceiverЈ¬Supports IEEE 802.3az-2010,; Part Reference: U6701; Manufacturer: RealTek(ИркЕ); Value: RTL8211F-CG; Priority: A; RK PN: RTL8211F-CG; Part Type: Ethernet; Manufacturer PN: RTL8211F-CG; Created by: JJJ
Y6700 = CRYSTAL_4P: ОЮФґѕ§ХсЈ¬25MЈ¬3225,ЎА10ppmЈ¬10pFЈ¬Hosonic; Part Reference: Y6700; Manufacturer: Hosonic(єиРЗµзЧУ); Value: 25MHz; RK PN: E3SB25.0000F10E11; Priority: A; Part Type: CRYSTAL; Manufacturer PN: E3SB25.0000F10E11; Created by: JJJ